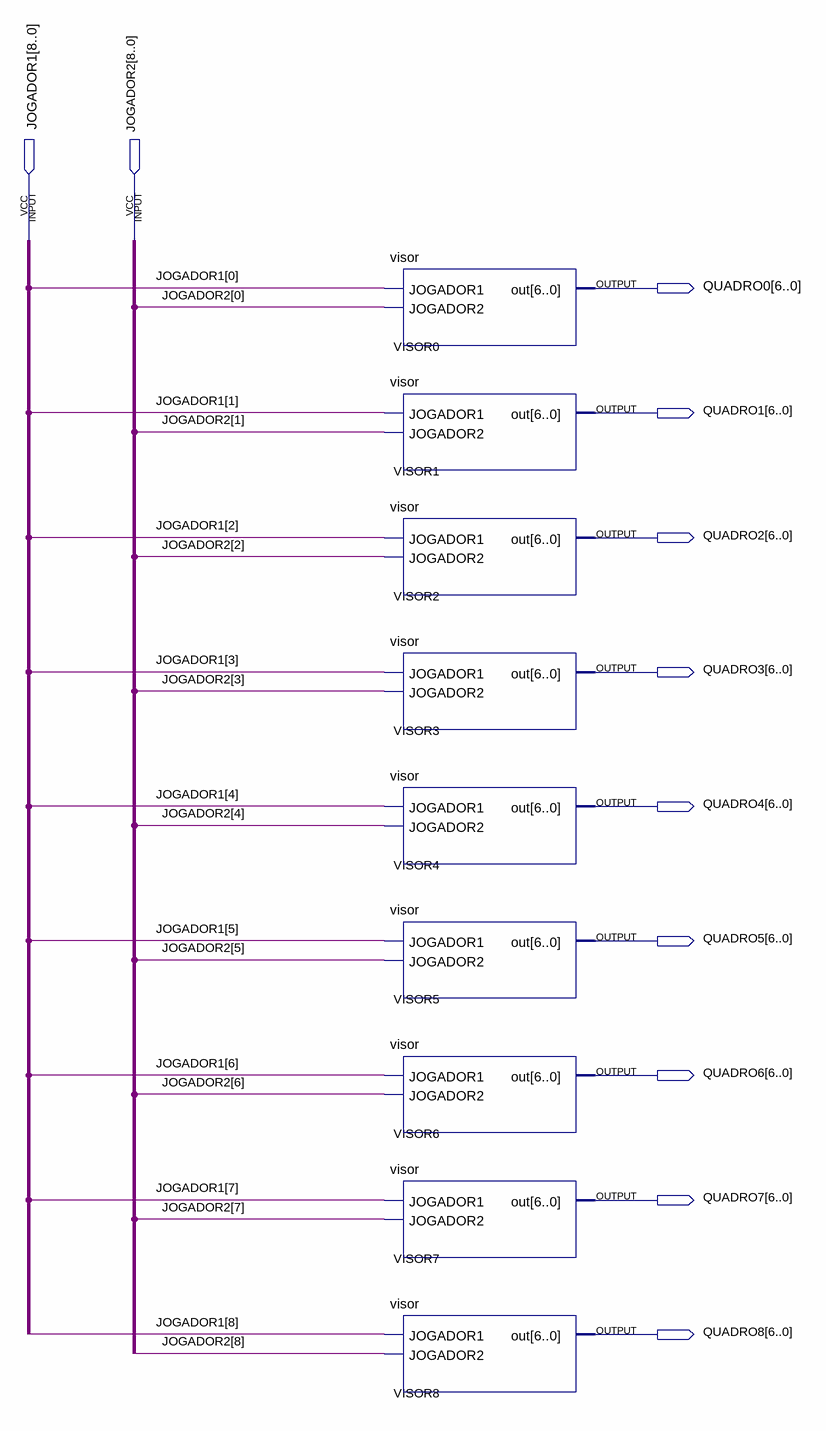
[diagram p0: schematic sheet]
// Quartus schematic visores.bdf as structural Verilog: 9 symbols, 11 pins
module visores (
  input  [8:0] JOGADOR1,
  input  [8:0] JOGADOR2,
  output [6:0] QUADRO0,
  output [6:0] QUADRO1,
  output [6:0] QUADRO2,
  output [6:0] QUADRO3,
  output [6:0] QUADRO4,
  output [6:0] QUADRO5,
  output [6:0] QUADRO6,
  output [6:0] QUADRO7,
  output [6:0] QUADRO8
);

  visor VISOR0 (.JOGADOR1(JOGADOR1[0]), .JOGADOR2(JOGADOR2[0]), .out(QUADRO0));
  visor VISOR1 (.JOGADOR1(JOGADOR1[1]), .JOGADOR2(JOGADOR2[1]), .out(QUADRO1));
  visor VISOR2 (.JOGADOR1(JOGADOR1[2]), .JOGADOR2(JOGADOR2[2]), .out(QUADRO2));
  visor VISOR3 (.JOGADOR1(JOGADOR1[3]), .JOGADOR2(JOGADOR2[3]), .out(QUADRO3));
  visor VISOR4 (.JOGADOR1(JOGADOR1[4]), .JOGADOR2(JOGADOR2[4]), .out(QUADRO4));
  visor VISOR5 (.JOGADOR1(JOGADOR1[5]), .JOGADOR2(JOGADOR2[5]), .out(QUADRO5));
  visor VISOR6 (.JOGADOR1(JOGADOR1[6]), .JOGADOR2(JOGADOR2[6]), .out(QUADRO6));
  visor VISOR7 (.JOGADOR1(JOGADOR1[7]), .JOGADOR2(JOGADOR2[7]), .out(QUADRO7));
  visor VISOR8 (.JOGADOR1(JOGADOR1[8]), .JOGADOR2(JOGADOR2[8]), .out(QUADRO8));
endmodule
